# EAGLE design mymote-logger (EAGLE 8.3.2)
PROJECT_AUTHOR: TINKERMAN <xose.perez@gmail.com>; PROJECT_LICENSE: CC-SA-BY 3.0; PROJECT_NAME: MYMOTE LOGGER; PROJECT_VERSION: 0.2.20171019
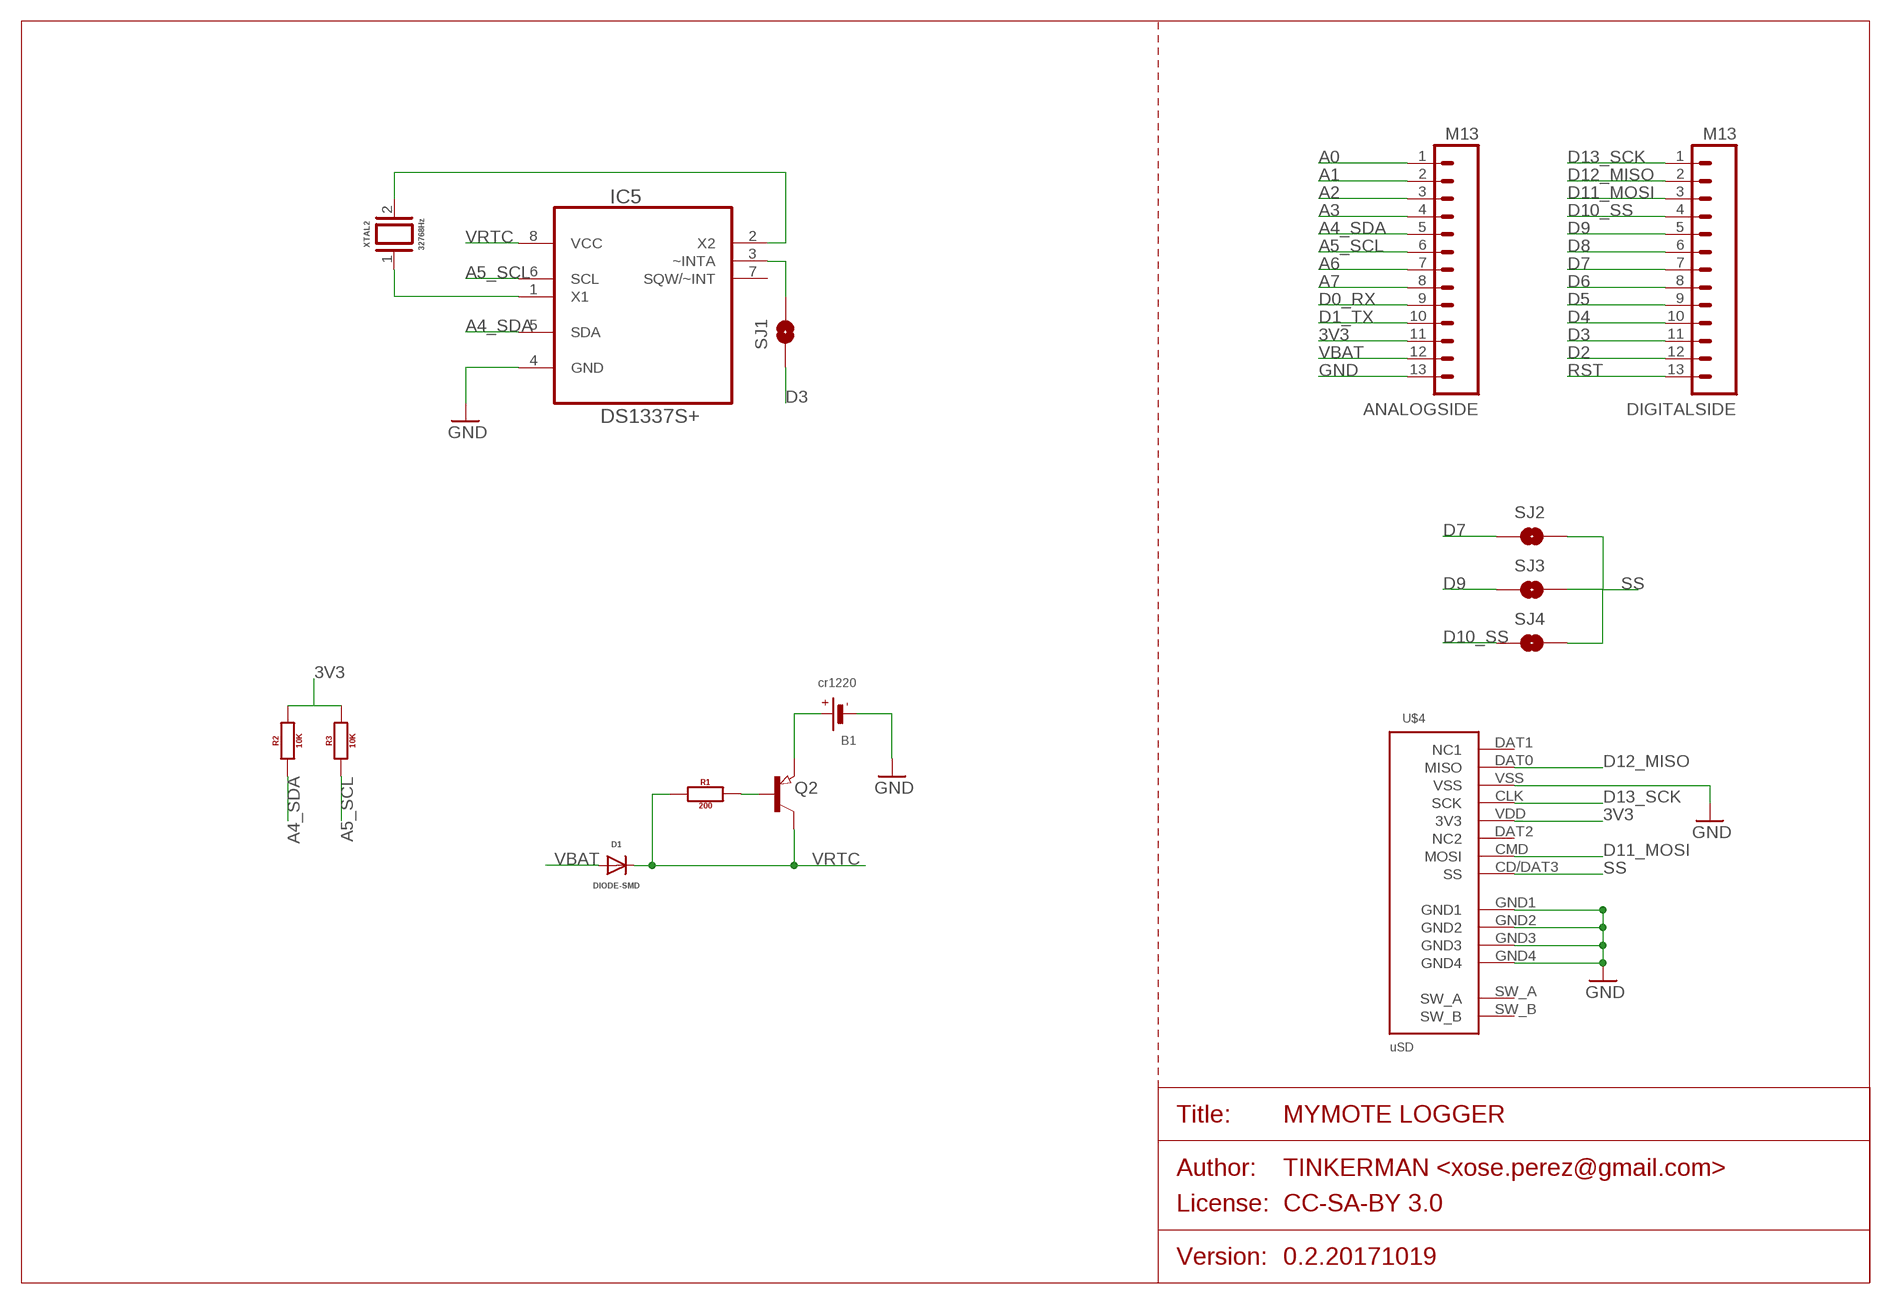
[diagram p0: schematic, sheet 1]

## Parts
ANALOGSIDE  M13  [1X13_NO_SILK]
B1  cr1220  BATTERYCR1220_2  [CR1220-2]
D1  DIODE-SMD  [0805_DIODE]
DIGITALSIDE  M13  [1X13_NO_SILK]
IC5  DS1337S+  [SOIC127P600X175-8N]
Q2  PNP-TRANSISTOR_SOT23  [SOT23]
R1  200  RESISTOR0805  [0805]
R2  10K  RESISTOR0805  [0805]
R3  10K  RESISTOR0805  [0805]
SJ1  SOLDERJUMPERNO  [SJ_2S-NO]
SJ2  SOLDERJUMPERNO  [SJ_2S-NO]
SJ3  SOLDERJUMPERNO  [SJ_2S-NO]
SJ4  SOLDERJUMPERNO  [SJ_2S-NO]
U$4  uSD  MICROSD  [DM3D]
XTAL2  32768Hz  CRYSTAL_TC38H  [TC38H]

## Nets
3V3: ANALOGSIDE.11 R2.2 R3.2 U$4.VDD(3V3)
A0: ANALOGSIDE.1
A1: ANALOGSIDE.2
A2: ANALOGSIDE.3
A3: ANALOGSIDE.4
A4_SDA: ANALOGSIDE.5 IC5.5(SDA) R2.1
A5_SCL: ANALOGSIDE.6 IC5.6(SCL) R3.1
A6: ANALOGSIDE.7
A7: ANALOGSIDE.8
D0_RX: ANALOGSIDE.9
D1_TX: ANALOGSIDE.10
D2: DIGITALSIDE.12
D3: DIGITALSIDE.11 SJ1.1
D4: DIGITALSIDE.10
D5: DIGITALSIDE.9
D6: DIGITALSIDE.8
D7: DIGITALSIDE.7 SJ2.1
D8: DIGITALSIDE.6
D9: DIGITALSIDE.5 SJ3.1
D10_SS: DIGITALSIDE.4 SJ4.1
D11_MOSI: DIGITALSIDE.3 U$4.CMD(MOSI)
D12_MISO: DIGITALSIDE.2 U$4.DAT0(MISO)
D13_SCK: DIGITALSIDE.1 U$4.CLK(SCK)
GND [power]: ANALOGSIDE.13 B1.- IC5.4(GND) U$4.GND1 U$4.GND2 U$4.GND3 U$4.GND4 U$4.VSS
N$6: IC5.1(X1) XTAL2.1
N$9: IC5.2(X2) XTAL2.2
N$10: Q2.1(B) R1.2
N$13: B1.+ Q2.2(E)
N$14: IC5.3(~INTA) SJ1.2
RST: DIGITALSIDE.13
SS: SJ2.2 SJ3.2 SJ4.2 U$4.CD/DAT3(SS)
VBAT: ANALOGSIDE.12 D1.A
VRTC: D1.C IC5.8(VCC) Q2.3(C) R1.1
Unconnected: IC5.7(SQW/~INT) U$4.DAT1(NC1) U$4.DAT2(NC2) U$4.SW_A U$4.SW_B

## Library data of the parts
ANALOGSIDE DIGITALSIDE = xose:M13
B1 = microbuilder:BATTERY: CR1220 SMT - Digikey: 3001K-ND CD2032 BAT-HLD-001 - Digikey: BAT-HLD-001-ND
D1 = xose:DIODE
IC5 = xose:DS1337S+: 64 x 8, Serial, I2C Real-Time Clock; MPN: DS1337S+; OC_FARNELL: 1379748; OC_NEWARK: 08J6237; PACKAGE: SOIC-8; SUPPLIER: Maxim
Q2 = semicon-smd-ipc:PNP-TRANSISTOR_: PNP TRANSISTOR
R1-R3 = xose:RESISTOR: Generic EU resistor symbol
SJ1-SJ4 = xose:SOLDERJUMPER: Solder Jumper Standard SMD solder jumper. Used to automate production. Two varients : Normally Open and Normally Closed are the same, but have different paste layers. NC will have a large amount of paste and should jumper during reflow.
U$4 = xose:MICROSD
XTAL2 = xose:CRYSTAL_TC38H

## Net classes
1 power: width 0.381 mm, clearance 0.254 mm

## Board
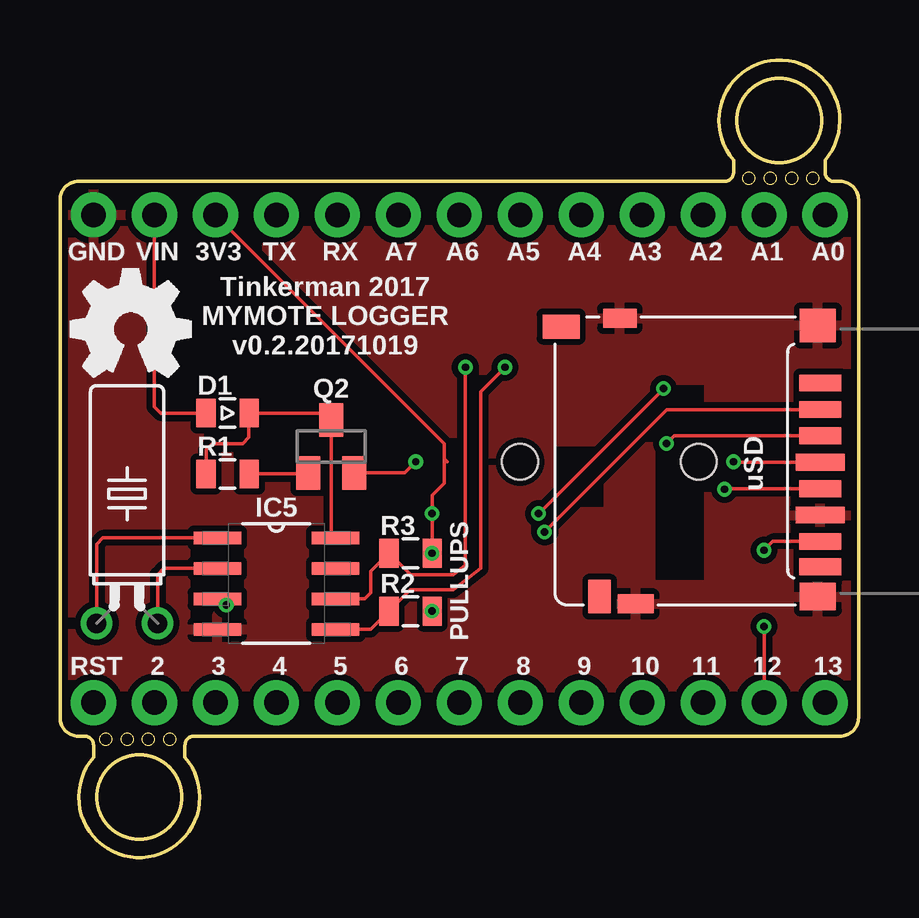
[diagram p1: board, top side]
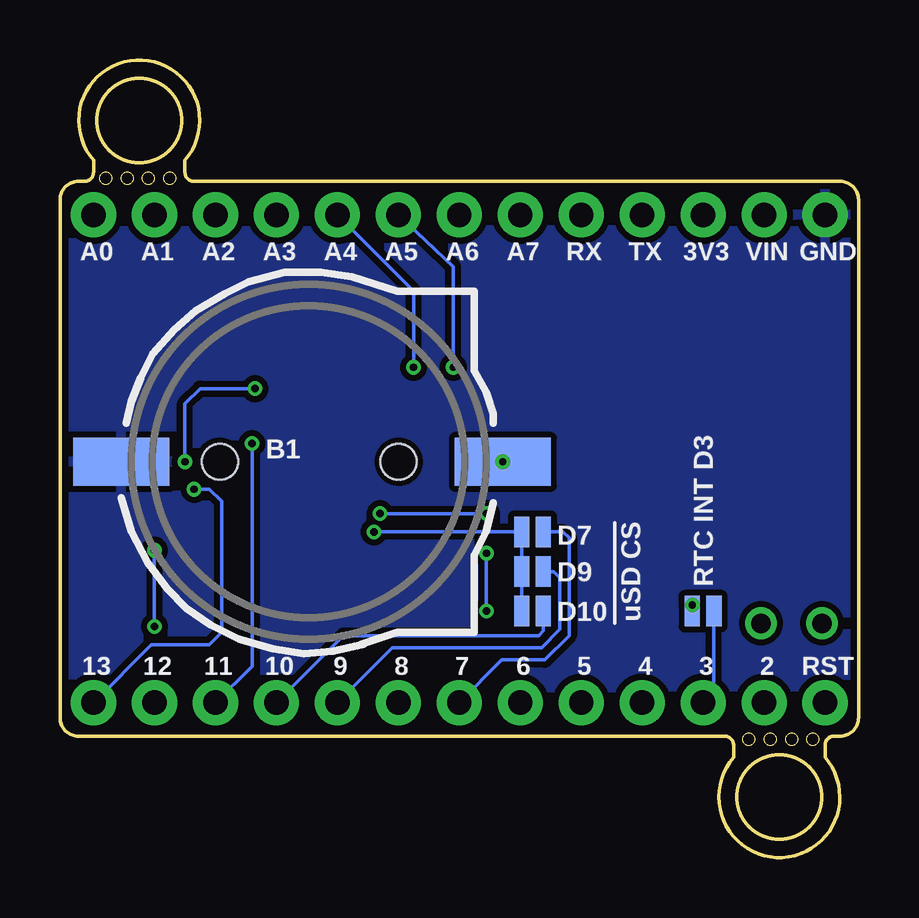
[diagram p2: board, bottom side, seen from below]

Size 33.27 x 33.23 mm. Coordinates in mm from the lower left corner, seen from the top.
Outline: 0.71,5.06 0.76,5.06
Outline: 0.76,28.17 0.71,28.17
Outline: 0,5.77 0,5.82
Outline: 0,27.41 0,27.46
Outline: 0,5.82 0,27.41
Outline: 0,27.41 arc-90 0.76,28.17
Outline: 0.76,5.06 1.02,5.06 arc-90 1.4,4.68 1.4,4.17 arc262 5.21,4.17 5.21,4.68 arc-90 5.59,5.06 32.51,5.06 arc90 33.27,5.82 33.27,27.41 arc90 32.51,28.17 32.26,28.17 arc-90 31.88,28.55 31.88,29.06 arc262 28.07,29.06 28.07,28.55 arc-90 27.69,28.17 0.76,28.17
Outline: 0.76,5.06 arc-90 0,5.82
Outline: circle at 3.3,2.52 radius 1.75
Outline: circle at 1.91,4.93 radius 0.25
Outline: circle at 2.79,4.93 radius 0.25
Outline: circle at 3.68,4.93 radius 0.25
Outline: circle at 29.97,30.71 radius 1.75
Outline: circle at 31.37,28.3 radius 0.25
Outline: circle at 30.48,28.3 radius 0.25
Outline: circle at 29.59,28.3 radius 0.25
Outline: circle at 4.57,4.93 radius 0.25
Outline: circle at 28.7,28.3 radius 0.25
Copper layers (1*16): Top 0.035mm / dielectric 1.5mm / Bottom 0.035mm
Design rules "seedstudio-2layer": minimum track width 6mil, minimum drill 12mil, track to track 6mil, track to pad 6mil, pad to pad 6mil, via to via 6mil, smd to smd 0mil, copper to edge 10mil, drill to drill 10mil, minimum pad ring 10mil, minimum via ring 6mil, stop-mask expansion 2mil, vias tented up to drill 100mil, thermal gap 10mil

### Footprints (pad centres in the part's own frame; a part is rotated, then mirrored left to right if it is on the bottom)
1X13_NO_SILK = drill 1.016 pad 1.88: 1 0,0; 2 2.54,0; 3 5.08,0; 4 7.62,0; 5 10.16,0; 6 12.7,0; 7 15.24,0; 8 17.78,0; 9 20.32,0; 10 22.86,0; 11 25.4,0; 12 27.94,0; 13 30.48,0
CR1220-2 = smd 4 x 2: + 8.29,0; - -7.6,0 | hole 1.5: 3.95,0; -3.5,0
0805_DIODE = smd 0.8 x 1.2: A -0.9,0; C 0.9,0
SOIC127P600X175-8N = smd 1.981 x 0.533: 1 -2.464,1.905; 2 -2.464,0.635; 3 -2.464,-0.635; 4 -2.464,-1.905; 5 2.464,-1.905; 6 2.464,-0.635; 7 2.464,0.635; 8 2.464,1.905
SOT23 = smd 1 x 1.4: 1 -0.95,-1.1; 2 0.95,-1.1; 3 0,1.1
0805 = smd 0.8 x 1.2: 1 -0.9,0; 2 0.9,0
SJ_2S-NO = smd 0.635 x 1.27: 1 -0.45,0; 2 0.45,0
DM3D = smd 0.7 x 1.75: CD/DAT3 8.15,0.45; CLK 4.85,0.45; CMD 7.05,0.45; DAT0 2.65,0.45; DAT1 1.6,0.45; DAT2 9.25,0.45 | smd 0.8 x 1.5: GND1 0.05,8.15 | smd 0.8 x 1.4: GND2 11.95,8.8 | smd 1.4 x 1.5: GND3 11.65,0.55 | smd 1.143 x 1.499: GND4 0.35,0.55 | smd 1 x 1.55: SW_A 11.6,11.25 | smd 1.397 x 0.94: SW_B 0.35,9.65 | smd 0.7 x 2.032: VDD 5.95,0.45; VSS 3.75,0.45
TC38H = drill 0.813: 1 -1.27,0; 2 1.27,0

### Placement (x,y rotation side)
ANALOGSIDE  31.88,26.77 180 top
B1  23.11,16.49 0 bottom
D1  6.99,18.52 0 top
DIGITALSIDE  31.88,6.45 180 top
IC5  9.02,11.41 0 top
Q2  11.3,17.12 0 top
R1  6.99,15.98 0 top
R2  14.61,10.26 0 top
R3  14.61,12.68 0 top
SJ1  6.48,10.26 180 bottom
SJ2  13.59,13.57 180 bottom
SJ3  13.59,11.92 180 bottom
SJ4  13.59,10.26 180 bottom
U$4  32.13,10.52 90 top
XTAL2  2.79,9.76 0 top

### Tracks (layer width: path | path; a pad name or v marks a point on that pad's centre or on a via)
3V3  (via drill 0.3)
  Top 0.152: R3.2 v15.51,14.33 15.51,15.1 16,15.6 16,16.49 | 16,16.61 16,16.49 | 16,16.61 16,17.25 ANALOGSIDE.11 | 16.02,16.47 16,16.49 | 16.13,16.49 16,16.61 | U$4.VDD 28.09,16.47 v28.07,16.49 | v25.15,19.54 v19.94,14.33
  Bottom 0.152: v28.07,16.49 28.07,18.9 27.43,19.54 v25.15,19.54 | v19.94,14.33 v15.51,14.33 | R3.2 R2.2
  other vias: 15.51,12.68 15.51,10.26
A4_SDA  (via drill 0.3)
  Top 0.152: v18.54,20.42 17.53,19.41 17.53,12.04 16.38,11.15 14.59,11.15 R2.1 12.94,9.5 IC5.5
  Bottom 0.152: v18.54,20.42 18.54,23.6 ANALOGSIDE.5
A5_SCL  (via drill 0.3)
  Top 0.152: v16.89,20.42 16.89,12.17 16.38,11.79 14.61,11.79 R3.1 12.95,11.93 12.95,11.03 12.7,10.77 IC5.6
  Bottom 0.152: v16.89,20.42 16.89,24.62 ANALOGSIDE.6
D3
  Bottom 0.152: DIGITALSIDE.11 6.03,6.9 SJ1.1
D7
  Bottom 0.152: SJ2.1 12.32,13.57 12.06,13.31 12.06,9.25 13.08,8.23 14.86,8.23 DIGITALSIDE.7
D9
  Bottom 0.152: SJ3.1 12.7,11.92 12.45,11.66 12.45,9.5 13.21,8.74 19.43,8.74 DIGITALSIDE.5
D10_SS
  Bottom 0.152: SJ4.1 13.14,9.44 13.34,9.25 21.46,9.25 DIGITALSIDE.4
D11_MOSI  (via drill 0.3)
  Top 0.152: U$4.CMD 25.59,17.57 v25.27,17.25
  Bottom 0.152: DIGITALSIDE.3 25.27,7.98 v25.27,17.25
D12_MISO  (via drill 0.3)
  Top 0.152: U$4.DAT0 29.7,13.17 v29.34,12.8 | v29.34,9.63 DIGITALSIDE.2
  Bottom 0.152: v29.34,12.8 v29.34,9.63
D13_SCK  (via drill 0.3)
  Top 0.152: U$4.CLK 27.71,15.37 v27.69,15.34
  Bottom 0.152: v27.69,15.34 27.05,15.34 26.54,14.84 26.54,9.38 27.05,8.87 29.46,8.87 DIGITALSIDE.1
GND
  pour Top: -0.76,29.7 33.66,29.7 33.78,4.55 -0.64,4.55
  pour Bottom: -0.13,28.93 33.66,28.93 33.53,4.8 -0.25,4.8
N$6
  Top 0.152: IC5.1 1.78,13.31 1.52,13.06 XTAL2.1
N$9
  Top 0.152: IC5.2 4.32,12.04 4.06,11.79 XTAL2.2
N$10
  Top 0.152: R1.2 10.31,15.98 Q2.1
N$13  (via drill 0.3)
  Top 0.152: Q2.2 14.36,16.02 B1.+
  other vias: 14.82,16.49
N$14  (via drill 0.3)
  Top 0.152: IC5.3 6.93,10.4 v6.93,10.52
  Bottom 0.152: SJ1.2 v6.93,10.52
SS  (via drill 0.3)
  Top 0.152: v20.19,13.57 25.27,18.65 31.66,18.65 U$4.CD/DAT3
  Bottom 0.152: SJ4.2 SJ3.2 SJ2.2 v20.19,13.57
VBAT
  Top 0.152: D1.A 4.19,18.52 3.94,18.77 ANALOGSIDE.12
VRTC
  Top 0.152: IC5.8 11.3,13.49 Q2.3 | 11.01,18.52 Q2.3 | 11.01,18.52 D1.C 7.87,18.51 7.87,17.5 7.62,17.25 6.35,17.25 6.08,16.98 R1.1 | 11.01,18.52 Q2.3

### Text on the board
tNames: GND | VIN | 3V3 | TX | RX | A7 | A6 | A5 | A4 | A3 | A2 | A1 | A0 | Tinkerman 2017 / MYMOTE LOGGER / v0.2.20171019 | PULLUPS | RST | 2 | 3 | 4 | 5 | 6 | 7 | 8 | 9 | 10 | 11 | 12 | 13
bNames: GND | VIN | 3V3 | TX | RX | A7 | A6 | A5 | A4 | A3 | A2 | A1 | A0 | D7 | uSD CS | D9 | RTC INT D3 | D10 | RST | 2 | 3 | 4 | 5 | 6 | 7 | 8 | 9 | 10 | 11 | 12 | 13